# Altium schematic sheet PAGE07 SDRAM.SchDoc
size 246 x 182 mm; SheetNumber: 7; SheetTotal: 9
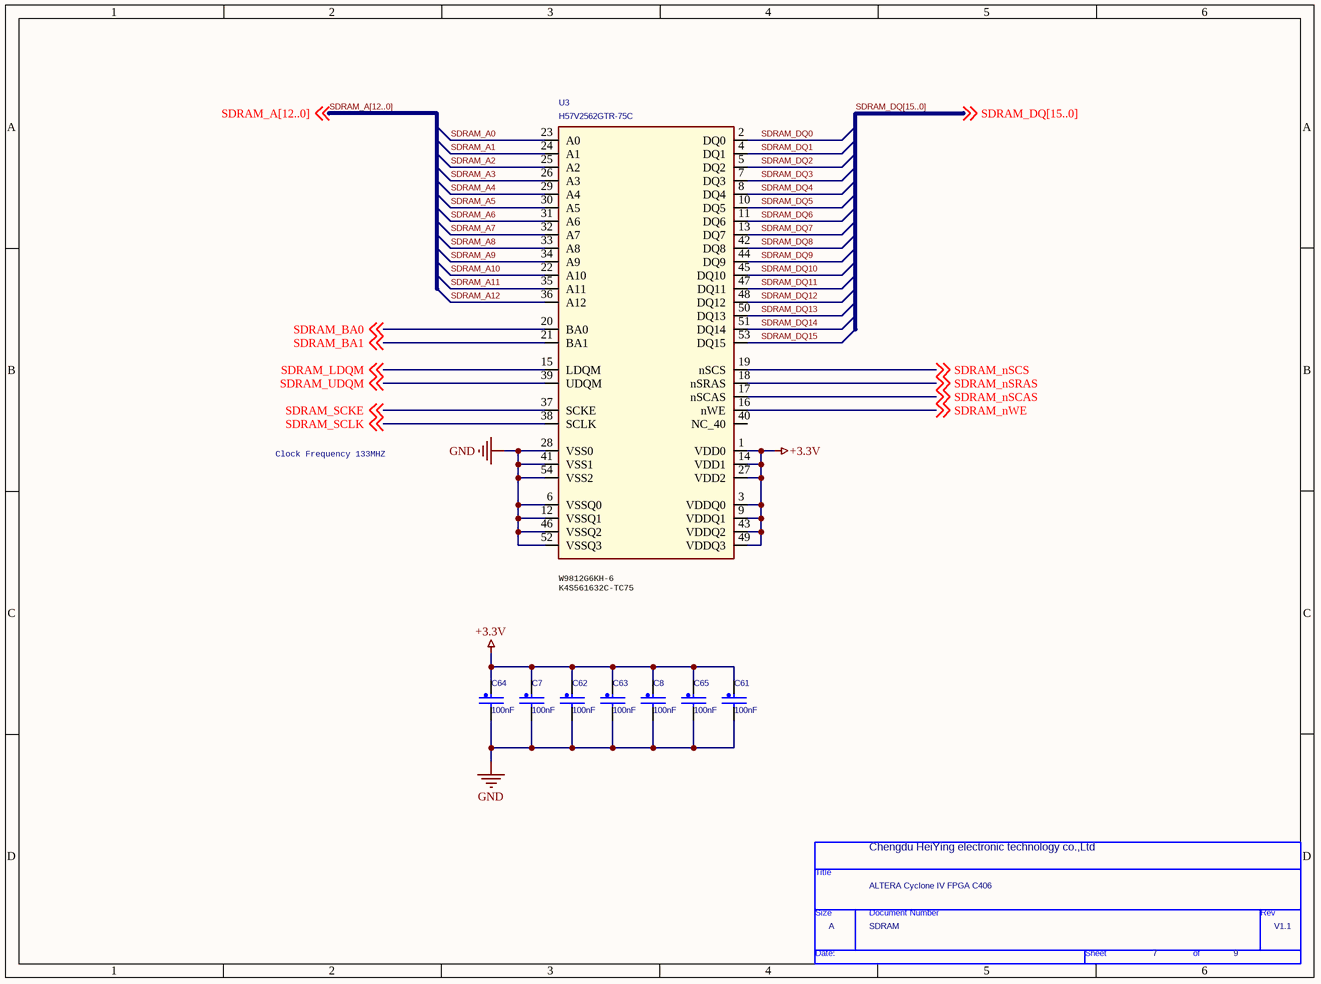
[diagram p0: PAGE07 SDRAM.SchDoc]

## Parts
*  Page Count: 9  Page Number: 7  Page Size: A  Title: ALTERA Cyclone IV FPGA C406  RevCode: V1.1  Doc: SDRAM  (hidden comment: TitleBlock0)  (graphical)
C7  100nF  [C0402]
C8  100nF  [C0402]
C61  100nF  [C0402]
C62  100nF  [C0402]
C63  100nF  [C0402]
C64  100nF  [C0402]
C65  100nF  [C0402]
U3  H57V2562GTR-75C  [TSOP54-400]

## Nets
+3.3V: C7.1 C8.1 C61.1 C62.1 C63.1 C64.1 C65.1 U3.1(VDD0) U3.3(VDDQ0) U3.9(VDDQ1) U3.14(VDD1) U3.27(VDD2) U3.43(VDDQ2) U3.49(VDDQ3)
GND: C7.2 C8.2 C61.2 C62.2 C63.2 C64.2 C65.2 U3.6(VSSQ0) U3.12(VSSQ1) U3.28(VSS0) U3.41(VSS1) U3.46(VSSQ2) U3.52(VSSQ3) U3.54(VSS2)
SDRAM_A0: U3.23(A0)
SDRAM_A1: U3.24(A1)
SDRAM_A2: U3.25(A2)
SDRAM_A3: U3.26(A3)
SDRAM_A4: U3.29(A4)
SDRAM_A5: U3.30(A5)
SDRAM_A6: U3.31(A6)
SDRAM_A7: U3.32(A7)
SDRAM_A8: U3.33(A8)
SDRAM_A9: U3.34(A9)
SDRAM_A10: U3.22(A10)
SDRAM_A11: U3.35(A11)
SDRAM_A12: U3.36(A12)
SDRAM_BA0: U3.20(BA0) ; off-sheet SDRAM_BA0
SDRAM_BA1: U3.21(BA1) ; off-sheet SDRAM_BA1
SDRAM_DQ0: U3.2(DQ0)
SDRAM_DQ1: U3.4(DQ1)
SDRAM_DQ2: U3.5(DQ2)
SDRAM_DQ3: U3.7(DQ3)
SDRAM_DQ4: U3.8(DQ4)
SDRAM_DQ5: U3.10(DQ5)
SDRAM_DQ6: U3.11(DQ6)
SDRAM_DQ7: U3.13(DQ7)
SDRAM_DQ8: U3.42(DQ8)
SDRAM_DQ9: U3.44(DQ9)
SDRAM_DQ10: U3.45(DQ10)
SDRAM_DQ11: U3.47(DQ11)
SDRAM_DQ12: U3.48(DQ12)
SDRAM_DQ13: U3.50(DQ13)
SDRAM_DQ14: U3.51(DQ14)
SDRAM_DQ15: U3.53(DQ15)
SDRAM_LDQM: U3.15(LDQM) ; off-sheet SDRAM_LDQM
SDRAM_nSCAS: U3.17(nSCAS) ; off-sheet SDRAM_nSCAS
SDRAM_nSCS: U3.19(nSCS) ; off-sheet SDRAM_nSCS
SDRAM_nSRAS: U3.18(nSRAS) ; off-sheet SDRAM_nSRAS
SDRAM_nWE: U3.16(nWE) ; off-sheet SDRAM_nWE
SDRAM_SCKE: U3.37(SCKE) ; off-sheet SDRAM_SCKE
SDRAM_SCLK: U3.38(SCLK) ; off-sheet SDRAM_SCLK
SDRAM_UDQM: U3.39(UDQM) ; off-sheet SDRAM_UDQM

Not connected (* = marked no-connect by the designer): U3 40(NC_40)

## Buses and harness runs
bus SDRAM_A[12..0]
bus SDRAM_DQ[15..0]

## Notes on the sheet
- Clock Frequency 133MHZ
- (near U3) W9812G6KH-6
  K4S561632C-TC75
- Chengdu HeiYing electronic technology co.,Ltd
- (in symbol TitleBlock0) Title; Size; Document Number; Rev; Date:; Sheet; of

## Library data of the parts
C7 C63 C65 = CAP_NP: CAP CER 0.1UF 6.3V 10% X5R 0201; FPLIST: CC0201,CC0201_HD,CC0201_3PIN,0201_CC; CAD_APPROVED: Yes; MFG_PN01: GRM033R60J104KE19D; MFG_NAME01: MURATA; AGILE_PN: 150-75429; HEIGHT: 0.33MM; ROHS: Yes; Tolerance: 10%
C8 C61 C62 C64 = CAP_NP: CAP CER 0.1UF 6.3V 10% X5R 0201; AGILE_PN: 150-75429; MFG_NAME01: MURATA; MFG_PN01: GRM033R60J104KE19D; CAD_APPROVED: Yes; FPLIST: CC0201,CC0201_HD,CC0201_3PIN,0201_CC; Tolerance: 10%; ROHS: Yes; HEIGHT: 0.33MM
U3 = K4S561632C-TC75_0
* = TitleBlock0: Page Create Date: March  8, 1995